# Altium project RK_NVR_DEMO1_RK3588_LP4XD200P232SD8_V21_20211228.PrjPcb (part 19 of 19)
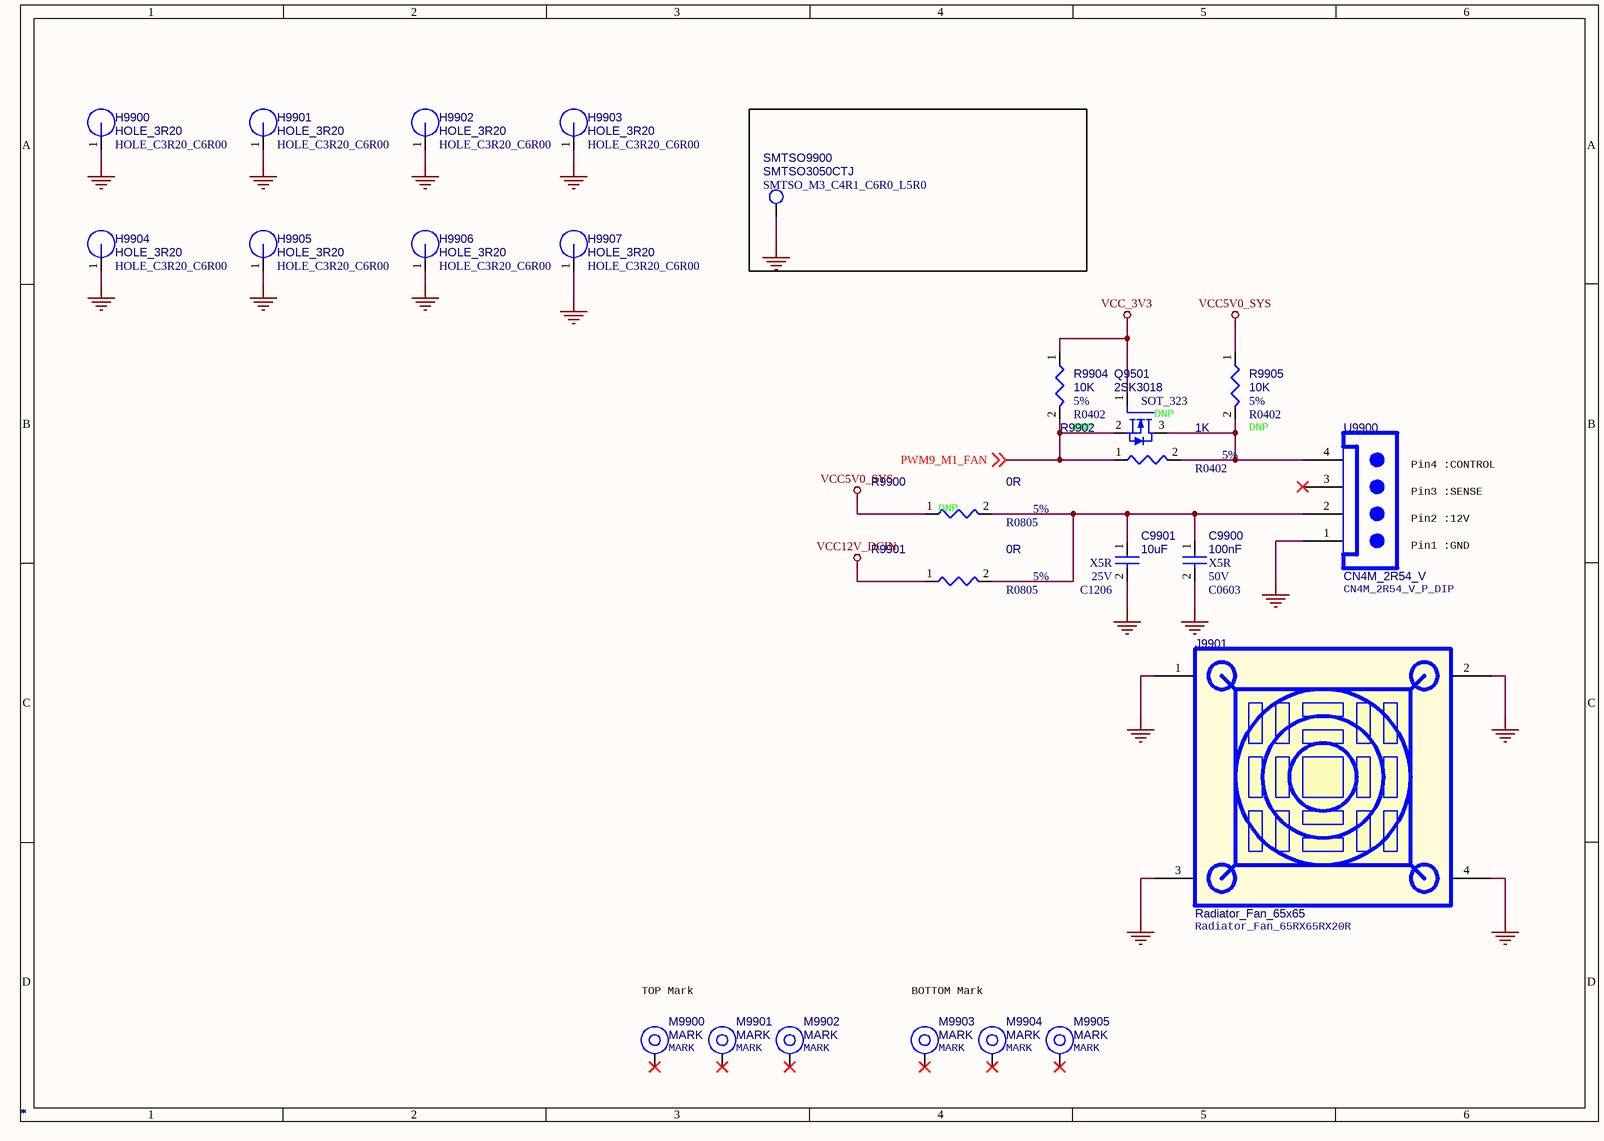
[diagram p81: 99.Mark_Hole_Heatsink.SchDoc]

## Nets that join several sheets
(0.75-0.85V): 12.RK3588 DDR Controler (C1215.1 C1218.1 U1000.L15 U1000.N12), 21.Power-PMIC_RK806-1 (R2141.2)
GND: 11.RK3588_OSC_PLL_PMUIO (19 pins), 12.RK3588 DDR Controler (33 pins), 13.RK3588_Flash_SD Controller (5 pins), 14.RK3588_USB30_USB20_Ctrl (18 pins), 15.RK3588_SARADC_1.8V Only GPIO (12 pins), 16.RK3588_MIPI  Interface (11 pins), 17.RK3588_HDMI_eDP Interface (23 pins), 18.RK3588_PCIE30_PCIE20_SATA30 (16 pins), 19.RK3588_1.8V_ 3.3V GPIO (C1901.2 C1902.2 C1903.2 C1905.2), 20.Power_DC IN (49 pins), 21.Power-PMIC_RK806-1 (69 pins), 22.Power_Ext Discrete_RTC IC (49 pins), 25.USB2_USB3_TypeC Port (75 pins), 38.DRAM-LPDDR4X_200P_1X32bit (205 pins), 40.Flash-eMMC Flash (23 pins), 43.Flash-SPI FLASH(Option) (C4300.2 C4301.2 U4300.4 U4300.9), 47.VI-Camera_MIPI-CSI (27 pins), 50.VO-HDMI2.1 TX (42 pins), 51.VO-HDMI2.0 TX(DP to HDMI) (69 pins), 55.VO-HDMI1.4 TX(MIPI to HDMI) (67 pins), 67.Ethernet-GEPHY_RGMII0 (50 pins), 68.Ethernet-GEPHY_RGMII1 (47 pins), 70.Audio Port (23 pins), 82.SATA-SATA PM0 (69 pins), 83.SATA-SATA PM1 (61 pins), 84.PCIE-PCIE3.0_1x4Lanes_RC_64P (71 pins), 90.IR Receiver_LED (11 pins), 91.Debug UART_JTAG (26 pins), 92.KEY (8 pins), 93.HW_ID (R9301.2), 95.RS485_RS232 (16 pins), 98.Power Test (21 pins), 99.Mark_Hole_Heatsink (16 pins)
VCC3V3_SATAPM0: 82.SATA-SATA PM0 (34 pins), 83.SATA-SATA PM1 (R8311.1)
VCC4V0_SYS: 20.Power_DC IN (6 pins), 21.Power-PMIC_RK806-1 (28 pins), 22.Power_Ext Discrete_RTC IC (18 pins), 51.VO-HDMI2.0 TX(DP to HDMI) (C5119.1 U5101.4), 55.VO-HDMI1.4 TX(MIPI to HDMI) (C5520.1 U5501.4), 82.SATA-SATA PM0 (5 pins), 84.PCIE-PCIE3.0_1x4Lanes_RC_64P (C8421.1 U8401.1)
VCC5V0_SYS: 20.Power_DC IN (C2035.1 R2001.1 R2024.2), 25.USB2_USB3_TypeC Port (12 pins), 47.VI-Camera_MIPI-CSI (C4700.1 C4701.1 U4700.77 U4700.79), 50.VO-HDMI2.1 TX (8 pins), 51.VO-HDMI2.0 TX(DP to HDMI) (D5100.1 D5101.1 R5120.1), 55.VO-HDMI1.4 TX(MIPI to HDMI) (D5500.1 D5501.1 R5540.1), 98.Power Test (J9800.5), 99.Mark_Hole_Heatsink (R9900.1 R9905.1)
VCC5V0_SYS_P: 20.Power_DC IN (7 pins), 98.Power Test (J9800.3)
VCC12V_DCIN: 20.Power_DC IN (14 pins), 47.VI-Camera_MIPI-CSI (C4702.1 C4703.1 U4700.80), 84.PCIE-PCIE3.0_1x4Lanes_RC_64P (7 pins), 99.Mark_Hole_Heatsink (R9901.1)
VCC_1V1_NLDO: 20.Power_DC IN (C2024.1 R2010.2 R2014.2), 21.Power-PMIC_RK806-1 (C2167.1 C2171.1 U2100.9 U2100.13)
VCC_1V8: 11.RK3588_OSC_PLL_PMUIO (C1107.1 C1112.1 U1000.N28 U1000.R27), 13.RK3588_Flash_SD Controller (C1300.1 C1301.1 U1000.AA7 U1000.V26), 15.RK3588_SARADC_1.8V Only GPIO (6 pins), 19.RK3588_1.8V_ 3.3V GPIO (10 pins), 21.Power-PMIC_RK806-1 (C2149.1 R2130.1 R2137.1 R2138.1), 38.DRAM-LPDDR4X_200P_1X32bit (C3843.1 R3803.2), 40.Flash-eMMC Flash (13 pins), 43.Flash-SPI FLASH(Option) (5 pins), 47.VI-Camera_MIPI-CSI (C4704.1 C4705.1 U4700.61), 50.VO-HDMI2.1 TX (R5000.1 R5005.1 R5014.1 R5017.1), 51.VO-HDMI2.0 TX(DP to HDMI) (R5135.1), 67.Ethernet-GEPHY_RGMII0 (R6730.1), 70.Audio Port (C7006.1 C7007.1 R7002.1 U7000.3), 98.Power Test (J9800.40)
VCC_1V8_P: 21.Power-PMIC_RK806-1 (5 pins), 98.Power Test (J9800.38)
VCC_2V0_PLDO: 20.Power_DC IN (R2014.1), 21.Power-PMIC_RK806-1 (C2154.1 C2156.1 R2131.2 U2100.59)
VCC_3V3: 11.RK3588_OSC_PLL_PMUIO (8 pins), 13.RK3588_Flash_SD Controller (C1302.1 U1000.Y7), 14.RK3588_USB30_USB20_Ctrl (C1421.1 U1000.AJ10), 19.RK3588_1.8V_ 3.3V GPIO (C1901.1 C1905.1 U1000.AC26 U1000.W26), 21.Power-PMIC_RK806-1 (C2140.1 R2127.1), 22.Power_Ext Discrete_RTC IC (D2200.2 R2204.1), 25.USB2_USB3_TypeC Port (C2519.1 R2500.2 U2503.3 U2503.4), 40.Flash-eMMC Flash (7 pins), 47.VI-Camera_MIPI-CSI (C4706.1 C4707.1 U4700.62), 50.VO-HDMI2.1 TX (10 pins), 51.VO-HDMI2.0 TX(DP to HDMI) (C5107.1 C5108.1 Q5100.2 R5126.1), 55.VO-HDMI1.4 TX(MIPI to HDMI) (C5503.1 C5504.1 Q5500.2 R5545.1), 67.Ethernet-GEPHY_RGMII0 (R6733.1), 68.Ethernet-GEPHY_RGMII1 (R6830.1 R6833.1), 70.Audio Port (BP7000.1 C7012.1), 82.SATA-SATA PM0 (R8211.1), 90.IR Receiver_LED (5 pins), 91.Debug UART_JTAG (5 pins), 95.RS485_RS232 (6 pins), 98.Power Test (J9800.11), 99.Mark_Hole_Heatsink (Q9501.1 R9904.1)
VCC_3V3_P: 21.Power-PMIC_RK806-1 (5 pins), 98.Power Test (J9800.9)
VCCA1V2_IMAGE: 16.RK3588_MIPI  Interface (C1608.1 C1609.1 U1000.AH19), 21.Power-PMIC_RK806-1 (C2159.1 U2100.57)
VCCA1V8_IMAGE: 16.RK3588_MIPI  Interface (7 pins), 17.RK3588_HDMI_eDP Interface (10 pins), 21.Power-PMIC_RK806-1 (R2133.2), 98.Power Test (J9800.30)
VCCA1V8_IMAGE_P: 21.Power-PMIC_RK806-1 (C2157.1 R2133.1 U2100.58), 98.Power Test (J9800.28)
VCCA1V8_PLDO6: 21.Power-PMIC_RK806-1 (C2158.1 U2100.20), 38.DRAM-LPDDR4X_200P_1X32bit (R3800.2)
VCCA_1V8: 11.RK3588_OSC_PLL_PMUIO (5 pins), 12.RK3588 DDR Controler (C1214.1 C1217.1 U1000.K16 U1000.M12), 14.RK3588_USB30_USB20_Ctrl (9 pins), 15.RK3588_SARADC_1.8V Only GPIO (C1503.1 R1502.1 R1503.1 U1000.AH18), 18.RK3588_PCIE30_PCIE20_SATA30 (12 pins), 21.Power-PMIC_RK806-1 (R2132.2), 93.HW_ID (R9300.1), 98.Power Test (J9800.24)
VCCA_1V8_P: 21.Power-PMIC_RK806-1 (C2155.1 R2132.1 U2100.60), 98.Power Test (J9800.22)
VCCA_3V3: 21.Power-PMIC_RK806-1 (R2135.2), 70.Audio Port (6 pins)
VDD1V2_SATAPM0: 82.SATA-SATA PM0 (22 pins), 83.SATA-SATA PM1 (R8312.1)
VDD2_DDR: 12.RK3588 DDR Controler (R1205.2), 21.Power-PMIC_RK806-1 (C2100.1 R2102.1), 38.DRAM-LPDDR4X_200P_1X32bit (83 pins), 98.Power Test (J9800.46)
VDD2_DDR_P: 21.Power-PMIC_RK806-1 (7 pins), 98.Power Test (J9800.44)
VDD_CPU_BIG0: 22.Power_Ext Discrete_RTC IC (8 pins), 98.Power Test (J9800.17)
VDD_CPU_BIG0_P: 22.Power_Ext Discrete_RTC IC (9 pins), 98.Power Test (J9800.15)
VDD_CPU_BIG1: 22.Power_Ext Discrete_RTC IC (9 pins), 98.Power Test (J9800.23)
VDD_CPU_BIG1_P: 22.Power_Ext Discrete_RTC IC (9 pins), 98.Power Test (J9800.21)
VDD_CPU_LIT: 21.Power-PMIC_RK806-1 (7 pins), 98.Power Test (J9800.52)
VDD_CPU_LIT_P: 21.Power-PMIC_RK806-1 (7 pins), 98.Power Test (J9800.50)
VDD_DDR: 12.RK3588 DDR Controler (22 pins), 21.Power-PMIC_RK806-1 (6 pins), 98.Power Test (J9800.39)
VDD_DDR_P: 21.Power-PMIC_RK806-1 (7 pins), 98.Power Test (J9800.37)
VDD_GPU: 21.Power-PMIC_RK806-1 (7 pins), 98.Power Test (J9800.45)
VDD_GPU_P: 21.Power-PMIC_RK806-1 (7 pins), 98.Power Test (J9800.43)
VDD_LOGIC: 21.Power-PMIC_RK806-1 (7 pins), 98.Power Test (J9800.51)
VDD_LOGIC_P: 21.Power-PMIC_RK806-1 (7 pins), 98.Power Test (J9800.49)
VDD_NPU: 22.Power_Ext Discrete_RTC IC (6 pins), 98.Power Test (J9800.57)
VDD_NPU_P: 22.Power_Ext Discrete_RTC IC (9 pins), 98.Power Test (J9800.55)
VDD_VDENC: 21.Power-PMIC_RK806-1 (7 pins), 98.Power Test (J9800.34)
VDD_VDENC_P: 21.Power-PMIC_RK806-1 (7 pins), 98.Power Test (J9800.32)
VDDA0V75_IMAGE: 17.RK3588_HDMI_eDP Interface (11 pins), 21.Power-PMIC_RK806-1 (R2142.2), 98.Power Test (J9800.18)
VDDA0V75_IMAGE_P: 21.Power-PMIC_RK806-1 (C2169.1 R2142.1 U2100.11), 98.Power Test (J9800.16)
VDDA_0V75: 14.RK3588_USB30_USB20_Ctrl (C1412.1 U1000.AH10), 15.RK3588_SARADC_1.8V Only GPIO (C1504.1 U1000.AD3), 16.RK3588_MIPI  Interface (8 pins), 18.RK3588_PCIE30_PCIE20_SATA30 (6 pins), 21.Power-PMIC_RK806-1 (R2144.2), 98.Power Test (J9800.33)
VDDA_0V75_P: 21.Power-PMIC_RK806-1 (C2172.1 R2144.1 U2100.8), 98.Power Test (J9800.31)
VDDA_0V75_PMU: 11.RK3588_OSC_PLL_PMUIO (6 pins), 21.Power-PMIC_RK806-1 (R2139.2), 98.Power Test (J9800.12)
VDDA_0V75_PMU_P: 21.Power-PMIC_RK806-1 (C2164.1 R2139.1 U2100.14), 98.Power Test (J9800.10)
VDDA_0V85: 14.RK3588_USB30_USB20_Ctrl (8 pins), 18.RK3588_PCIE30_PCIE20_SATA30 (6 pins), 21.Power-PMIC_RK806-1 (R2143.2), 98.Power Test (J9800.6)
VDDA_0V85_P: 21.Power-PMIC_RK806-1 (C2170.1 R2143.1 U2100.10), 98.Power Test (J9800.4)
VDDQ_DDR: 12.RK3588 DDR Controler (27 pins), 21.Power-PMIC_RK806-1 (8 pins), 38.DRAM-LPDDR4X_200P_1X32bit (R3808.2), 98.Power Test (J9800.29)
VDDQ_DDR_P: 21.Power-PMIC_RK806-1 (7 pins), 98.Power Test (J9800.27)
DDR_CH0_A0_A: 12.RK3588 DDR Controler (U1000.T7), 38.DRAM-LPDDR4X_200P_1X32bit (U3800.H2)
DDR_CH0_A0_B: 12.RK3588 DDR Controler (U1000.M8), 38.DRAM-LPDDR4X_200P_1X32bit (U3800.R2)
DDR_CH0_A1_A: 12.RK3588 DDR Controler (U1000.T8), 38.DRAM-LPDDR4X_200P_1X32bit (U3800.J2)
DDR_CH0_A1_B: 12.RK3588 DDR Controler (U1000.M5), 38.DRAM-LPDDR4X_200P_1X32bit (U3800.P2)
DDR_CH0_A2_A: 12.RK3588 DDR Controler (U1000.P4), 38.DRAM-LPDDR4X_200P_1X32bit (U3800.H9)
DDR_CH0_A2_B: 12.RK3588 DDR Controler (U1000.N5), 38.DRAM-LPDDR4X_200P_1X32bit (U3800.R9)
DDR_CH0_A3_A: 12.RK3588 DDR Controler (U1000.P5), 38.DRAM-LPDDR4X_200P_1X32bit (U3800.H10)
DDR_CH0_A3_B: 12.RK3588 DDR Controler (U1000.N4), 38.DRAM-LPDDR4X_200P_1X32bit (U3800.R10)
DDR_CH0_A4_A: 12.RK3588 DDR Controler (U1000.R1), 38.DRAM-LPDDR4X_200P_1X32bit (U3800.H11)
DDR_CH0_A4_B: 12.RK3588 DDR Controler (U1000.K1), 38.DRAM-LPDDR4X_200P_1X32bit (U3800.R11)
DDR_CH0_A5_A: 12.RK3588 DDR Controler (U1000.P2), 38.DRAM-LPDDR4X_200P_1X32bit (U3800.J11)
DDR_CH0_A5_B: 12.RK3588 DDR Controler (U1000.L2), 38.DRAM-LPDDR4X_200P_1X32bit (U3800.P11)
DDR_CH0_CLKN_A: 12.RK3588 DDR Controler (U1000.N1), 38.DRAM-LPDDR4X_200P_1X32bit (U3800.J9)
DDR_CH0_CLKN_B: 12.RK3588 DDR Controler (U1000.M1), 38.DRAM-LPDDR4X_200P_1X32bit (U3800.P9)
DDR_CH0_CLKP_A: 12.RK3588 DDR Controler (U1000.N2), 38.DRAM-LPDDR4X_200P_1X32bit (U3800.J8)
DDR_CH0_CLKP_B: 12.RK3588 DDR Controler (U1000.M2), 38.DRAM-LPDDR4X_200P_1X32bit (U3800.P8)
DDR_CH0_DM0_A: 12.RK3588 DDR Controler (U1000.Y4), 38.DRAM-LPDDR4X_200P_1X32bit (U3800.C3)
DDR_CH0_DM0_B: 12.RK3588 DDR Controler (U1000.G4), 38.DRAM-LPDDR4X_200P_1X32bit (U3800.Y3)
DDR_CH0_DM1_A: 12.RK3588 DDR Controler (U1000.AB4), 38.DRAM-LPDDR4X_200P_1X32bit (U3800.C10)
DDR_CH0_DM1_B: 12.RK3588 DDR Controler (U1000.E4), 38.DRAM-LPDDR4X_200P_1X32bit (U3800.Y10)
DDR_CH0_DQ0_A: 12.RK3588 DDR Controler (U1000.U1), 38.DRAM-LPDDR4X_200P_1X32bit (U3800.B2)
DDR_CH0_DQ0_B: 12.RK3588 DDR Controler (U1000.H1), 38.DRAM-LPDDR4X_200P_1X32bit (U3800.AA2)
DDR_CH0_DQ1_A: 12.RK3588 DDR Controler (U1000.T2), 38.DRAM-LPDDR4X_200P_1X32bit (U3800.C2)
DDR_CH0_DQ1_B: 12.RK3588 DDR Controler (U1000.J2), 38.DRAM-LPDDR4X_200P_1X32bit (U3800.Y2)
DDR_CH0_DQ2_A: 12.RK3588 DDR Controler (U1000.T1), 38.DRAM-LPDDR4X_200P_1X32bit (U3800.E2)
DDR_CH0_DQ2_B: 12.RK3588 DDR Controler (U1000.J1), 38.DRAM-LPDDR4X_200P_1X32bit (U3800.V2)
DDR_CH0_DQ3_A: 12.RK3588 DDR Controler (U1000.R2), 38.DRAM-LPDDR4X_200P_1X32bit (U3800.F2)
DDR_CH0_DQ3_B: 12.RK3588 DDR Controler (U1000.K2), 38.DRAM-LPDDR4X_200P_1X32bit (U3800.U2)
DDR_CH0_DQ4_A: 12.RK3588 DDR Controler (U1000.W1), 38.DRAM-LPDDR4X_200P_1X32bit (U3800.F4)
DDR_CH0_DQ4_B: 12.RK3588 DDR Controler (U1000.F1), 38.DRAM-LPDDR4X_200P_1X32bit (U3800.U4)
DDR_CH0_DQ5_A: 12.RK3588 DDR Controler (U1000.V2), 38.DRAM-LPDDR4X_200P_1X32bit (U3800.E4)
DDR_CH0_DQ5_B: 12.RK3588 DDR Controler (U1000.G2), 38.DRAM-LPDDR4X_200P_1X32bit (U3800.V4)
DDR_CH0_DQ6_A: 12.RK3588 DDR Controler (U1000.V1), 38.DRAM-LPDDR4X_200P_1X32bit (U3800.C4)
DDR_CH0_DQ6_B: 12.RK3588 DDR Controler (U1000.G1), 38.DRAM-LPDDR4X_200P_1X32bit (U3800.Y4)
DDR_CH0_DQ7_A: 12.RK3588 DDR Controler (U1000.U2), 38.DRAM-LPDDR4X_200P_1X32bit (U3800.B4)
DDR_CH0_DQ7_B: 12.RK3588 DDR Controler (U1000.H2), 38.DRAM-LPDDR4X_200P_1X32bit (U3800.AA4)
DDR_CH0_DQ8_A: 12.RK3588 DDR Controler (U1000.AB2), 38.DRAM-LPDDR4X_200P_1X32bit (U3800.B11)
DDR_CH0_DQ8_B: 12.RK3588 DDR Controler (U1000.D2), 38.DRAM-LPDDR4X_200P_1X32bit (U3800.AA11)
DDR_CH0_DQ9_A: 12.RK3588 DDR Controler (U1000.AB1), 38.DRAM-LPDDR4X_200P_1X32bit (U3800.C11)
DDR_CH0_DQ9_B: 12.RK3588 DDR Controler (U1000.C1), 38.DRAM-LPDDR4X_200P_1X32bit (U3800.Y11)
DDR_CH0_DQ10_A: 12.RK3588 DDR Controler (U1000.AC1), 38.DRAM-LPDDR4X_200P_1X32bit (U3800.E11)
DDR_CH0_DQ10_B: 12.RK3588 DDR Controler (U1000.C2), 38.DRAM-LPDDR4X_200P_1X32bit (U3800.V11)
DDR_CH0_DQ11_A: 12.RK3588 DDR Controler (U1000.AC2), 38.DRAM-LPDDR4X_200P_1X32bit (U3800.F11)
DDR_CH0_DQ11_B: 12.RK3588 DDR Controler (U1000.B1), 38.DRAM-LPDDR4X_200P_1X32bit (U3800.U11)
DDR_CH0_DQ12_A: 12.RK3588 DDR Controler (U1000.Y1), 38.DRAM-LPDDR4X_200P_1X32bit (U3800.F9)
DDR_CH0_DQ12_B: 12.RK3588 DDR Controler (U1000.F2), 38.DRAM-LPDDR4X_200P_1X32bit (U3800.U9)
DDR_CH0_DQ13_A: 12.RK3588 DDR Controler (U1000.Y2), 38.DRAM-LPDDR4X_200P_1X32bit (U3800.E9)
DDR_CH0_DQ13_B: 12.RK3588 DDR Controler (U1000.E1), 38.DRAM-LPDDR4X_200P_1X32bit (U3800.V9)
DDR_CH0_DQ14_A: 12.RK3588 DDR Controler (U1000.AA1), 38.DRAM-LPDDR4X_200P_1X32bit (U3800.C9)
DDR_CH0_DQ14_B: 12.RK3588 DDR Controler (U1000.E2), 38.DRAM-LPDDR4X_200P_1X32bit (U3800.Y9)
DDR_CH0_DQ15_A: 12.RK3588 DDR Controler (U1000.AA2), 38.DRAM-LPDDR4X_200P_1X32bit (U3800.B9)
DDR_CH0_DQ15_B: 12.RK3588 DDR Controler (U1000.D1), 38.DRAM-LPDDR4X_200P_1X32bit (U3800.AA9)
DDR_CH0_DQS0N_A: 12.RK3588 DDR Controler (U1000.U4), 38.DRAM-LPDDR4X_200P_1X32bit (U3800.E3)
DDR_CH0_DQS0N_B: 12.RK3588 DDR Controler (U1000.J7), 38.DRAM-LPDDR4X_200P_1X32bit (U3800.V3)
DDR_CH0_DQS0P_A: 12.RK3588 DDR Controler (U1000.U5), 38.DRAM-LPDDR4X_200P_1X32bit (U3800.D3)
DDR_CH0_DQS0P_B: 12.RK3588 DDR Controler (U1000.J8), 38.DRAM-LPDDR4X_200P_1X32bit (U3800.W3)
DDR_CH0_DQS1N_A: 12.RK3588 DDR Controler (U1000.AA4), 38.DRAM-LPDDR4X_200P_1X32bit (U3800.E10)
DDR_CH0_DQS1N_B: 12.RK3588 DDR Controler (U1000.F4), 38.DRAM-LPDDR4X_200P_1X32bit (U3800.V10)
DDR_CH0_DQS1P_A: 12.RK3588 DDR Controler (U1000.AA5), 38.DRAM-LPDDR4X_200P_1X32bit (U3800.D10)
DDR_CH0_DQS1P_B: 12.RK3588 DDR Controler (U1000.F5), 38.DRAM-LPDDR4X_200P_1X32bit (U3800.W10)
DDR_CH0_LP4/4X_CKE0/LP5_CS0_A: 12.RK3588 DDR Controler (U1000.P7), 38.DRAM-LPDDR4X_200P_1X32bit (R3801.1)
DDR_CH0_LP4/4X_CKE0/LP5_CS0_B: 12.RK3588 DDR Controler (U1000.L5), 38.DRAM-LPDDR4X_200P_1X32bit (R3804.1)
DDR_CH0_LP4/4X_CKE1/LP5_CS1_A: 12.RK3588 DDR Controler (U1000.N7), 38.DRAM-LPDDR4X_200P_1X32bit (R3802.1)
DDR_CH0_LP4/4X_CKE1/LP5_CS1_B: 12.RK3588 DDR Controler (U1000.L4), 38.DRAM-LPDDR4X_200P_1X32bit (R3805.1)
DDR_CH0_LP4/4X_CS0_A: 12.RK3588 DDR Controler (U1000.R6), 38.DRAM-LPDDR4X_200P_1X32bit (U3800.H4)
DDR_CH0_LP4/4X_CS0_B: 12.RK3588 DDR Controler (U1000.L7), 38.DRAM-LPDDR4X_200P_1X32bit (U3800.R4)
DDR_CH0_LP4/4X_CS1_A: 12.RK3588 DDR Controler (U1000.R7), 38.DRAM-LPDDR4X_200P_1X32bit (U3800.H3)
DDR_CH0_LP4/4X_CS1_B: 12.RK3588 DDR Controler (U1000.L8), 38.DRAM-LPDDR4X_200P_1X32bit (U3800.R3)
DDR_CH1_A0_C: 12.RK3588 DDR Controler (U1000.G12), 38.DRAM-LPDDR4X_200P_1X32bit (U3801.H2)
DDR_CH1_A0_D: 12.RK3588 DDR Controler (U1000.H15), 38.DRAM-LPDDR4X_200P_1X32bit (U3801.R2)
DDR_CH1_A1_C: 12.RK3588 DDR Controler (U1000.F12), 38.DRAM-LPDDR4X_200P_1X32bit (U3801.J2)
DDR_CH1_A1_D: 12.RK3588 DDR Controler (U1000.G14), 38.DRAM-LPDDR4X_200P_1X32bit (U3801.P2)
DDR_CH1_A2_C: 12.RK3588 DDR Controler (U1000.E13), 38.DRAM-LPDDR4X_200P_1X32bit (U3801.H9)
DDR_CH1_A2_D: 12.RK3588 DDR Controler (U1000.G13), 38.DRAM-LPDDR4X_200P_1X32bit (U3801.R9)
DDR_CH1_A3_C: 12.RK3588 DDR Controler (U1000.D13), 38.DRAM-LPDDR4X_200P_1X32bit (U3801.H10)
DDR_CH1_A3_D: 12.RK3588 DDR Controler (U1000.E14), 38.DRAM-LPDDR4X_200P_1X32bit (U3801.R10)
DDR_CH1_A4_C: 12.RK3588 DDR Controler (U1000.A10), 38.DRAM-LPDDR4X_200P_1X32bit (U3801.H11)
DDR_CH1_A4_D: 12.RK3588 DDR Controler (U1000.A15), 38.DRAM-LPDDR4X_200P_1X32bit (U3801.R11)
DDR_CH1_A5_C: 12.RK3588 DDR Controler (U1000.B11), 38.DRAM-LPDDR4X_200P_1X32bit (U3801.J11)
DDR_CH1_A5_D: 12.RK3588 DDR Controler (U1000.B14), 38.DRAM-LPDDR4X_200P_1X32bit (U3801.P11)
DDR_CH1_CLKN_C: 12.RK3588 DDR Controler (U1000.A12), 38.DRAM-LPDDR4X_200P_1X32bit (U3801.J9)
DDR_CH1_CLKN_D: 12.RK3588 DDR Controler (U1000.A13), 38.DRAM-LPDDR4X_200P_1X32bit (U3801.P9)
DDR_CH1_CLKP_C: 12.RK3588 DDR Controler (U1000.B12), 38.DRAM-LPDDR4X_200P_1X32bit (U3801.J8)
DDR_CH1_CLKP_D: 12.RK3588 DDR Controler (U1000.B13), 38.DRAM-LPDDR4X_200P_1X32bit (U3801.P8)
DDR_CH1_DM0_C: 12.RK3588 DDR Controler (U1000.F8), 38.DRAM-LPDDR4X_200P_1X32bit (U3801.C3)
DDR_CH1_DM0_D: 12.RK3588 DDR Controler (U1000.D20), 38.DRAM-LPDDR4X_200P_1X32bit (U3801.Y3)
DDR_CH1_DM1_C: 12.RK3588 DDR Controler (U1000.D4), 38.DRAM-LPDDR4X_200P_1X32bit (U3801.C10)
DDR_CH1_DM1_D: 12.RK3588 DDR Controler (U1000.D22), 38.DRAM-LPDDR4X_200P_1X32bit (U3801.Y10)
DDR_CH1_DQ0_C: 12.RK3588 DDR Controler (U1000.A8), 38.DRAM-LPDDR4X_200P_1X32bit (U3801.B2)
DDR_CH1_DQ0_D: 12.RK3588 DDR Controler (U1000.A17), 38.DRAM-LPDDR4X_200P_1X32bit (U3801.AA2)
DDR_CH1_DQ1_C: 12.RK3588 DDR Controler (U1000.B9), 38.DRAM-LPDDR4X_200P_1X32bit (U3801.C2)
DDR_CH1_DQ1_D: 12.RK3588 DDR Controler (U1000.B16), 38.DRAM-LPDDR4X_200P_1X32bit (U3801.Y2)
DDR_CH1_DQ2_C: 12.RK3588 DDR Controler (U1000.A9), 38.DRAM-LPDDR4X_200P_1X32bit (U3801.E2)
DDR_CH1_DQ2_D: 12.RK3588 DDR Controler (U1000.A16), 38.DRAM-LPDDR4X_200P_1X32bit (U3801.V2)
DDR_CH1_DQ3_C: 12.RK3588 DDR Controler (U1000.B10), 38.DRAM-LPDDR4X_200P_1X32bit (U3801.F2)
DDR_CH1_DQ3_D: 12.RK3588 DDR Controler (U1000.B15), 38.DRAM-LPDDR4X_200P_1X32bit (U3801.U2)
DDR_CH1_DQ4_C: 12.RK3588 DDR Controler (U1000.A6), 38.DRAM-LPDDR4X_200P_1X32bit (U3801.F4)
DDR_CH1_DQ4_D: 12.RK3588 DDR Controler (U1000.A19), 38.DRAM-LPDDR4X_200P_1X32bit (U3801.U4)
DDR_CH1_DQ5_C: 12.RK3588 DDR Controler (U1000.B7), 38.DRAM-LPDDR4X_200P_1X32bit (U3801.E4)
DDR_CH1_DQ5_D: 12.RK3588 DDR Controler (U1000.B18), 38.DRAM-LPDDR4X_200P_1X32bit (U3801.V4)
DDR_CH1_DQ6_C: 12.RK3588 DDR Controler (U1000.A7), 38.DRAM-LPDDR4X_200P_1X32bit (U3801.C4)
DDR_CH1_DQ6_D: 12.RK3588 DDR Controler (U1000.A18), 38.DRAM-LPDDR4X_200P_1X32bit (U3801.Y4)
DDR_CH1_DQ7_C: 12.RK3588 DDR Controler (U1000.B8), 38.DRAM-LPDDR4X_200P_1X32bit (U3801.B4)
DDR_CH1_DQ7_D: 12.RK3588 DDR Controler (U1000.B17), 38.DRAM-LPDDR4X_200P_1X32bit (U3801.AA4)
DDR_CH1_DQ8_C: 12.RK3588 DDR Controler (U1000.A3), 38.DRAM-LPDDR4X_200P_1X32bit (U3801.B11)
DDR_CH1_DQ8_D: 12.RK3588 DDR Controler (U1000.A22), 38.DRAM-LPDDR4X_200P_1X32bit (U3801.AA11)
DDR_CH1_DQ9_C: 12.RK3588 DDR Controler (U1000.B3), 38.DRAM-LPDDR4X_200P_1X32bit (U3801.C11)
DDR_CH1_DQ9_D: 12.RK3588 DDR Controler (U1000.B22), 38.DRAM-LPDDR4X_200P_1X32bit (U3801.Y11)
DDR_CH1_DQ10_C: 12.RK3588 DDR Controler (U1000.A2), 38.DRAM-LPDDR4X_200P_1X32bit (U3801.E11)
DDR_CH1_DQ10_D: 12.RK3588 DDR Controler (U1000.A23), 38.DRAM-LPDDR4X_200P_1X32bit (U3801.V11)
DDR_CH1_DQ11_C: 12.RK3588 DDR Controler (U1000.B2), 38.DRAM-LPDDR4X_200P_1X32bit (U3801.F11)
DDR_CH1_DQ11_D: 12.RK3588 DDR Controler (U1000.B23), 38.DRAM-LPDDR4X_200P_1X32bit (U3801.U11)
DDR_CH1_DQ12_C: 12.RK3588 DDR Controler (U1000.A5), 38.DRAM-LPDDR4X_200P_1X32bit (U3801.F9)
DDR_CH1_DQ12_D: 12.RK3588 DDR Controler (U1000.A20), 38.DRAM-LPDDR4X_200P_1X32bit (U3801.U9)
DDR_CH1_DQ13_C: 12.RK3588 DDR Controler (U1000.B5), 38.DRAM-LPDDR4X_200P_1X32bit (U3801.E9)
DDR_CH1_DQ13_D: 12.RK3588 DDR Controler (U1000.B20), 38.DRAM-LPDDR4X_200P_1X32bit (U3801.V9)
DDR_CH1_DQ14_C: 12.RK3588 DDR Controler (U1000.A4), 38.DRAM-LPDDR4X_200P_1X32bit (U3801.C9)
DDR_CH1_DQ14_D: 12.RK3588 DDR Controler (U1000.A21), 38.DRAM-LPDDR4X_200P_1X32bit (U3801.Y9)
DDR_CH1_DQ15_C: 12.RK3588 DDR Controler (U1000.B4), 38.DRAM-LPDDR4X_200P_1X32bit (U3801.B9)
DDR_CH1_DQ15_D: 12.RK3588 DDR Controler (U1000.B21), 38.DRAM-LPDDR4X_200P_1X32bit (U3801.AA9)
DDR_CH1_DQS0N_C: 12.RK3588 DDR Controler (U1000.D9), 38.DRAM-LPDDR4X_200P_1X32bit (U3801.E3)
DDR_CH1_DQS0N_D: 12.RK3588 DDR Controler (U1000.G16), 38.DRAM-LPDDR4X_200P_1X32bit (U3801.V3)
DDR_CH1_DQS0P_C: 12.RK3588 DDR Controler (U1000.E9), 38.DRAM-LPDDR4X_200P_1X32bit (U3801.D3)
DDR_CH1_DQS0P_D: 12.RK3588 DDR Controler (U1000.H16), 38.DRAM-LPDDR4X_200P_1X32bit (U3801.W3)
DDR_CH1_DQS1N_C: 12.RK3588 DDR Controler (U1000.D5), 38.DRAM-LPDDR4X_200P_1X32bit (U3801.E10)
DDR_CH1_DQS1N_D: 12.RK3588 DDR Controler (U1000.E21), 38.DRAM-LPDDR4X_200P_1X32bit (U3801.V10)
DDR_CH1_DQS1P_C: 12.RK3588 DDR Controler (U1000.E5), 38.DRAM-LPDDR4X_200P_1X32bit (U3801.D10)
DDR_CH1_DQS1P_D: 12.RK3588 DDR Controler (U1000.D21), 38.DRAM-LPDDR4X_200P_1X32bit (U3801.W10)
DDR_CH1_LP4/4X_CKE0/LP5_CS0_C: 12.RK3588 DDR Controler (U1000.D11), 38.DRAM-LPDDR4X_200P_1X32bit (R3812.1)
DDR_CH1_LP4/4X_CKE0/LP5_CS0_D: 12.RK3588 DDR Controler (U1000.D16), 38.DRAM-LPDDR4X_200P_1X32bit (R3814.1)
DDR_CH1_LP4/4X_CKE1/LP5_CS1_C: 12.RK3588 DDR Controler (U1000.E11), 38.DRAM-LPDDR4X_200P_1X32bit (R3813.1)
DDR_CH1_LP4/4X_CKE1/LP5_CS1_D: 12.RK3588 DDR Controler (U1000.E16), 38.DRAM-LPDDR4X_200P_1X32bit (R3815.1)
DDR_CH1_LP4/4X_CS0_C: 12.RK3588 DDR Controler (U1000.G11), 38.DRAM-LPDDR4X_200P_1X32bit (U3801.H4)
DDR_CH1_LP4/4X_CS0_D: 12.RK3588 DDR Controler (U1000.E19), 38.DRAM-LPDDR4X_200P_1X32bit (U3801.R4)
DDR_CH1_LP4/4X_CS1_C: 12.RK3588 DDR Controler (U1000.H11), 38.DRAM-LPDDR4X_200P_1X32bit (U3801.H3)
DDR_CH1_LP4/4X_CS1_D: 12.RK3588 DDR Controler (U1000.D19), 38.DRAM-LPDDR4X_200P_1X32bit (U3801.R3)
DDR_RESET: 12.RK3588 DDR Controler (U1000.T4), 38.DRAM-LPDDR4X_200P_1X32bit (C3844.1 C3888.1 U3800.T11 U3801.T11)
DP1_AUXN: 14.RK3588_USB30_USB20_Ctrl (U1000.AM10), 51.VO-HDMI2.0 TX(DP to HDMI) (C5100.1)
DP1_AUXP: 14.RK3588_USB30_USB20_Ctrl (U1000.AL10), 51.VO-HDMI2.0 TX(DP to HDMI) (C5101.1)
DP1_HPDIN_M2: 19.RK3588_1.8V_ 3.3V GPIO (U1000.A25), 51.VO-HDMI2.0 TX(DP to HDMI) (D5102.1 R5100.1 R5101.1 R5135.2)
DP1_TX0N: 14.RK3588_USB30_USB20_Ctrl (C1409.2), 51.VO-HDMI2.0 TX(DP to HDMI) (U5100.30)
DP1_TX0P: 14.RK3588_USB30_USB20_Ctrl (C1408.2), 51.VO-HDMI2.0 TX(DP to HDMI) (U5100.29)
DP1_TX1N: 14.RK3588_USB30_USB20_Ctrl (C1411.2), 51.VO-HDMI2.0 TX(DP to HDMI) (U5100.33)
DP1_TX1P: 14.RK3588_USB30_USB20_Ctrl (C1410.2), 51.VO-HDMI2.0 TX(DP to HDMI) (U5100.32)
DP1_TX2N: 14.RK3588_USB30_USB20_Ctrl (C1414.2), 51.VO-HDMI2.0 TX(DP to HDMI) (U5100.35)
DP1_TX2P: 14.RK3588_USB30_USB20_Ctrl (C1413.2), 51.VO-HDMI2.0 TX(DP to HDMI) (U5100.34)
DP1_TX3N: 14.RK3588_USB30_USB20_Ctrl (C1416.2), 51.VO-HDMI2.0 TX(DP to HDMI) (U5100.38)
DP1_TX3P: 14.RK3588_USB30_USB20_Ctrl (C1415.2), 51.VO-HDMI2.0 TX(DP to HDMI) (U5100.37)
DP2HDMI_PWREN_H_GPIO3_B2: 19.RK3588_1.8V_ 3.3V GPIO (U1000.AE28), 51.VO-HDMI2.0 TX(DP to HDMI) (R5129.1 R5131.1), 55.VO-HDMI1.4 TX(MIPI to HDMI) (R5549.1 R5552.1)
DP2HDMI_RSTn_GPIO0_D5: 11.RK3588_OSC_PLL_PMUIO (U1000.V28), 51.VO-HDMI2.0 TX(DP to HDMI) (R5122.1)
eMMC_CLKOUT: 13.RK3588_Flash_SD Controller (R1310.2 TP1300.1), 40.Flash-eMMC Flash (C4010.1 U4000.M6)
eMMC_CMD: 13.RK3588_Flash_SD Controller (R1315.2), 40.Flash-eMMC Flash (R4001.2 U4000.M5)
eMMC_D0: 13.RK3588_Flash_SD Controller (R1309.2), 40.Flash-eMMC Flash (R4000.2 U4000.A3)
eMMC_D1: 13.RK3588_Flash_SD Controller (R1311.2), 40.Flash-eMMC Flash (U4000.A4)
eMMC_D2: 13.RK3588_Flash_SD Controller (R1313.2), 40.Flash-eMMC Flash (U4000.A5)
eMMC_D3: 13.RK3588_Flash_SD Controller (R1314.2), 40.Flash-eMMC Flash (U4000.B2)
eMMC_D4: 13.RK3588_Flash_SD Controller (R1305.2), 40.Flash-eMMC Flash (U4000.B3)
eMMC_D5: 13.RK3588_Flash_SD Controller (R1306.2), 40.Flash-eMMC Flash (U4000.B4)
eMMC_D6: 13.RK3588_Flash_SD Controller (R1316.2), 40.Flash-eMMC Flash (U4000.B5)
eMMC_D7: 13.RK3588_Flash_SD Controller (R1308.2), 40.Flash-eMMC Flash (U4000.B6)
eMMC_DATA_STROBE: 13.RK3588_Flash_SD Controller (U1000.Y34), 40.Flash-eMMC Flash (R4003.1)
eMMC_RSTn: 13.RK3588_Flash_SD Controller (R1312.2), 40.Flash-eMMC Flash (C4009.1 R4002.2 U4000.K5)
ETH0_REFCLKO_25M: 15.RK3588_SARADC_1.8V Only GPIO (R1511.2), 67.Ethernet-GEPHY_RGMII0 (R6709.1)
ETH1_REFCLKO_25M: 19.RK3588_1.8V_ 3.3V GPIO (R1906.2), 68.Ethernet-GEPHY_RGMII1 (R6809.1)
Ethernet_LED_EN_H_GPIO3_C0: 19.RK3588_1.8V_ 3.3V GPIO (U1000.Y29), 90.IR Receiver_LED (R9007.1)
FSPI_CLK: 13.RK3588_Flash_SD Controller (R1304.2 TP1302.1), 43.Flash-SPI FLASH(Option) (U4300.6)
FSPI_CS0: 13.RK3588_Flash_SD Controller (R1307.2), 43.Flash-SPI FLASH(Option) (U4300.1)
FSPI_D0: 13.RK3588_Flash_SD Controller (R1300.2), 43.Flash-SPI FLASH(Option) (U4300.5)
FSPI_D1: 13.RK3588_Flash_SD Controller (R1301.2), 43.Flash-SPI FLASH(Option) (U4300.2)
FSPI_D2: 13.RK3588_Flash_SD Controller (R1302.2), 43.Flash-SPI FLASH(Option) (R4300.2 U4300.3)
FSPI_D3: 13.RK3588_Flash_SD Controller (R1303.2), 43.Flash-SPI FLASH(Option) (R4301.2 U4300.7)
GMAC0_MCLKINOUT: 15.RK3588_SARADC_1.8V Only GPIO (R1512.2), 67.Ethernet-GEPHY_RGMII0 (C6706.1 R6714.1 R6715.1)
GMAC0_MDC: 15.RK3588_SARADC_1.8V Only GPIO (R1513.2), 67.Ethernet-GEPHY_RGMII0 (U6701.13)
GMAC0_MDIO: 15.RK3588_SARADC_1.8V Only GPIO (U1000.AB33), 67.Ethernet-GEPHY_RGMII0 (R6735.2 U6701.14)
GMAC0_RSTn_L_GPIO4_B3: 19.RK3588_1.8V_ 3.3V GPIO (U1000.AM25), 67.Ethernet-GEPHY_RGMII0 (R6736.1)
GMAC0_RXCLK: 15.RK3588_SARADC_1.8V Only GPIO (U1000.AE32), 67.Ethernet-GEPHY_RGMII0 (C6724.1 R6741.2)
GMAC0_RXD0: 15.RK3588_SARADC_1.8V Only GPIO (U1000.AD32), 67.Ethernet-GEPHY_RGMII0 (R6737.2)
GMAC0_RXD1: 15.RK3588_SARADC_1.8V Only GPIO (U1000.AD31), 67.Ethernet-GEPHY_RGMII0 (R6738.2)
GMAC0_RXD2: 15.RK3588_SARADC_1.8V Only GPIO (U1000.AC32), 67.Ethernet-GEPHY_RGMII0 (R6739.2)
GMAC0_RXD3: 15.RK3588_SARADC_1.8V Only GPIO (U1000.AC31), 67.Ethernet-GEPHY_RGMII0 (R6740.2)
GMAC0_RXDV_CRS: 15.RK3588_SARADC_1.8V Only GPIO (U1000.AE31), 67.Ethernet-GEPHY_RGMII0 (R6742.2)
GMAC0_TXCLK: 15.RK3588_SARADC_1.8V Only GPIO (R1506.2), 67.Ethernet-GEPHY_RGMII0 (C6726.1 U6701.20)
GMAC0_TXD0: 15.RK3588_SARADC_1.8V Only GPIO (R1507.2), 67.Ethernet-GEPHY_RGMII0 (U6701.18)
GMAC0_TXD1: 15.RK3588_SARADC_1.8V Only GPIO (R1508.2), 67.Ethernet-GEPHY_RGMII0 (U6701.17)
GMAC0_TXD2: 15.RK3588_SARADC_1.8V Only GPIO (R1504.2), 67.Ethernet-GEPHY_RGMII0 (U6701.16)
GMAC0_TXD3: 15.RK3588_SARADC_1.8V Only GPIO (R1505.2), 67.Ethernet-GEPHY_RGMII0 (U6701.15)
GMAC0_TXEN: 15.RK3588_SARADC_1.8V Only GPIO (R1509.2), 67.Ethernet-GEPHY_RGMII0 (U6701.19)
GMAC1_MCLKINOUT: 19.RK3588_1.8V_ 3.3V GPIO (R1910.2), 68.Ethernet-GEPHY_RGMII1 (C6806.1 R6814.1 R6815.1)
GMAC1_MDC: 19.RK3588_1.8V_ 3.3V GPIO (R1911.2), 68.Ethernet-GEPHY_RGMII1 (U6801.13)
GMAC1_MDIO: 19.RK3588_1.8V_ 3.3V GPIO (U1000.Y30), 68.Ethernet-GEPHY_RGMII1 (R6835.2 U6801.14)
GMAC1_RSTn_L_GPIO4_A2: 19.RK3588_1.8V_ 3.3V GPIO (U1000.AM29), 68.Ethernet-GEPHY_RGMII1 (R6836.1)
GMAC1_RXCLK: 19.RK3588_1.8V_ 3.3V GPIO (R1905.2), 68.Ethernet-GEPHY_RGMII1 (C6823.1 R6841.2)
GMAC1_RXD0: 19.RK3588_1.8V_ 3.3V GPIO (U1000.AG29), 68.Ethernet-GEPHY_RGMII1 (R6837.2)
GMAC1_RXD1: 19.RK3588_1.8V_ 3.3V GPIO (U1000.AG28), 68.Ethernet-GEPHY_RGMII1 (R6838.2)
GMAC1_RXD2: 19.RK3588_1.8V_ 3.3V GPIO (R1902.2), 68.Ethernet-GEPHY_RGMII1 (R6839.2)
GMAC1_RXD3: 19.RK3588_1.8V_ 3.3V GPIO (R1903.2), 68.Ethernet-GEPHY_RGMII1 (R6840.2)
GMAC1_RXDV_CRS: 19.RK3588_1.8V_ 3.3V GPIO (U1000.AH29), 68.Ethernet-GEPHY_RGMII1 (R6842.2)
GMAC1_TXCLK: 19.RK3588_1.8V_ 3.3V GPIO (R1904.2), 68.Ethernet-GEPHY_RGMII1 (C6826.1 U6801.20)
GMAC1_TXD0: 19.RK3588_1.8V_ 3.3V GPIO (R1907.2), 68.Ethernet-GEPHY_RGMII1 (U6801.18)
GMAC1_TXD1: 19.RK3588_1.8V_ 3.3V GPIO (R1908.2), 68.Ethernet-GEPHY_RGMII1 (U6801.17)
GMAC1_TXD2: 19.RK3588_1.8V_ 3.3V GPIO (R1900.2), 68.Ethernet-GEPHY_RGMII1 (U6801.16)
GMAC1_TXD3: 19.RK3588_1.8V_ 3.3V GPIO (R1901.2), 68.Ethernet-GEPHY_RGMII1 (U6801.15)
GMAC1_TXEN: 19.RK3588_1.8V_ 3.3V GPIO (R1909.2), 68.Ethernet-GEPHY_RGMII1 (U6801.19)
HDD_LED_EN_H_GPIO3_C1: 19.RK3588_1.8V_ 3.3V GPIO (U1000.Y27), 90.IR Receiver_LED (R9008.1)
HDMI0_TX0N_PORT: 17.RK3588_HDMI_eDP Interface (C1701.2 R1706.1), 50.VO-HDMI2.1 TX (ED5001.2 ED5001.9 J5000.9)
HDMI0_TX0P_PORT: 17.RK3588_HDMI_eDP Interface (C1700.2 R1707.1), 50.VO-HDMI2.1 TX (ED5001.1 ED5001.10 J5000.7)
HDMI0_TX1N_PORT: 17.RK3588_HDMI_eDP Interface (C1703.2 R1704.1), 50.VO-HDMI2.1 TX (ED5000.5 ED5000.6 J5000.6)
HDMI0_TX1P_PORT: 17.RK3588_HDMI_eDP Interface (C1702.2 R1705.1), 50.VO-HDMI2.1 TX (ED5000.4 ED5000.7 J5000.4)
HDMI0_TX2N_PORT: 17.RK3588_HDMI_eDP Interface (C1705.2 R1702.1), 50.VO-HDMI2.1 TX (ED5000.2 ED5000.9 J5000.3)
HDMI0_TX2P_PORT: 17.RK3588_HDMI_eDP Interface (C1704.2 R1703.1), 50.VO-HDMI2.1 TX (ED5000.1 ED5000.10 J5000.1)
HDMI0_TX3N_PORT: 17.RK3588_HDMI_eDP Interface (C1707.2 R1700.1), 50.VO-HDMI2.1 TX (ED5001.5 ED5001.6 J5000.12)
HDMI0_TX3P_PORT: 17.RK3588_HDMI_eDP Interface (C1706.2 R1701.1), 50.VO-HDMI2.1 TX (ED5001.4 ED5001.7 J5000.10)
HDMI0_TX_ON_H: 17.RK3588_HDMI_eDP Interface (Q1700.1 Q1701.1 Q1702.1 Q1703.1), 19.RK3588_1.8V_ 3.3V GPIO (U1000.AL24)
HDMI1_TX0N_PORT: 17.RK3588_HDMI_eDP Interface (C1717.2 R1715.1), 50.VO-HDMI2.1 TX (ED5007.2 ED5007.9 J5001.9)
HDMI1_TX0P_PORT: 17.RK3588_HDMI_eDP Interface (C1716.2 R1716.1), 50.VO-HDMI2.1 TX (ED5007.1 ED5007.10 J5001.7)
HDMI1_TX1N_PORT: 17.RK3588_HDMI_eDP Interface (C1719.2 R1713.1), 50.VO-HDMI2.1 TX (ED5006.5 ED5006.6 J5001.6)
HDMI1_TX1P_PORT: 17.RK3588_HDMI_eDP Interface (C1718.2 R1714.1), 50.VO-HDMI2.1 TX (ED5006.4 ED5006.7 J5001.4)
HDMI1_TX2N_PORT: 17.RK3588_HDMI_eDP Interface (C1721.2 R1711.1), 50.VO-HDMI2.1 TX (ED5006.2 ED5006.9 J5001.3)
HDMI1_TX2P_PORT: 17.RK3588_HDMI_eDP Interface (C1720.2 R1712.1), 50.VO-HDMI2.1 TX (ED5006.1 ED5006.10 J5001.1)
HDMI1_TX3N_PORT: 17.RK3588_HDMI_eDP Interface (C1723.2 R1709.1), 50.VO-HDMI2.1 TX (ED5007.5 ED5007.6 J5001.12)
HDMI1_TX3P_PORT: 17.RK3588_HDMI_eDP Interface (C1722.2 R1710.1), 50.VO-HDMI2.1 TX (ED5007.4 ED5007.7 J5001.10)
HDMI1_TX_ON_H: 17.RK3588_HDMI_eDP Interface (Q1704.1 Q1705.1 Q1706.1 Q1707.1), 19.RK3588_1.8V_ 3.3V GPIO (U1000.AK25)
HDMITX0_CEC_M0: 19.RK3588_1.8V_ 3.3V GPIO (U1000.AK24), 50.VO-HDMI2.1 TX (R5011.1)
HDMITX0_HPDIN_M0: 19.RK3588_1.8V_ 3.3V GPIO (U1000.B26), 50.VO-HDMI2.1 TX (Q5006.3 R5000.2)
HDMITX0_SCL_M0: 19.RK3588_1.8V_ 3.3V GPIO (U1000.AJ28), 50.VO-HDMI2.1 TX (R5003.1)
HDMITX0_SDA_M0: 19.RK3588_1.8V_ 3.3V GPIO (U1000.AJ25), 50.VO-HDMI2.1 TX (R5008.1)
HDMITX1_CEC_M2: 19.RK3588_1.8V_ 3.3V GPIO (R1912.2), 50.VO-HDMI2.1 TX (R5023.1)
HDMITX1_HPDIN_M0: 19.RK3588_1.8V_ 3.3V GPIO (U1000.C24), 50.VO-HDMI2.1 TX (Q5008.3 R5014.2)
HDMITX1_SCL_M1: 19.RK3588_1.8V_ 3.3V GPIO (U1000.AG26), 50.VO-HDMI2.1 TX (R5015.1)
HDMITX1_SDA_M1: 19.RK3588_1.8V_ 3.3V GPIO (U1000.AH25), 50.VO-HDMI2.1 TX (R5020.1)
I2C0_SCL_M2: 11.RK3588_OSC_PLL_PMUIO (R1118.2 U1000.W30), 22.Power_Ext Discrete_RTC IC (U2200.A3 U2201.A3)
I2C0_SDA_M2: 11.RK3588_OSC_PLL_PMUIO (R1117.2 U1000.W29), 22.Power_Ext Discrete_RTC IC (U2200.B1 U2201.B1)
I2C2_SCL_M0: 11.RK3588_OSC_PLL_PMUIO (R1112.2 U1000.T28), 22.Power_Ext Discrete_RTC IC (U2202.A3)
I2C2_SDA_M0: 11.RK3588_OSC_PLL_PMUIO (R1111.2 U1000.T31), 22.Power_Ext Discrete_RTC IC (U2202.B1)
I2C3_SCL_M0: 15.RK3588_SARADC_1.8V Only GPIO (R1500.2 U1000.G27), 70.Audio Port (U7000.1)
I2C3_SDA_M0: 15.RK3588_SARADC_1.8V Only GPIO (R1501.2 U1000.G29), 70.Audio Port (U7000.19)
I2C4_SCL_M3_MIPI: 19.RK3588_1.8V_ 3.3V GPIO (R1913.2 U1000.A27), 47.VI-Camera_MIPI-CSI (U4700.48)
I2C4_SDA_M3_MIPI: 19.RK3588_1.8V_ 3.3V GPIO (R1914.2 U1000.A26), 47.VI-Camera_MIPI-CSI (U4700.46)
I2C5_SCL_M3_MIPI: 19.RK3588_1.8V_ 3.3V GPIO (R1916.2 U1000.E26), 47.VI-Camera_MIPI-CSI (U4700.47)
I2C5_SDA_M3_MIPI: 19.RK3588_1.8V_ 3.3V GPIO (R1915.2 U1000.E27), 47.VI-Camera_MIPI-CSI (U4700.45)
I2C6_SCL_M0: 11.RK3588_OSC_PLL_PMUIO (R1115.2 U1000.W31), 22.Power_Ext Discrete_RTC IC (R2209.2), 25.USB2_USB3_TypeC Port (U2503.6), 55.VO-HDMI1.4 TX(MIPI to HDMI) (R5502.2)
I2C6_SDA_M0: 11.RK3588_OSC_PLL_PMUIO (R1116.2 U1000.V31), 22.Power_Ext Discrete_RTC IC (R2210.2), 25.USB2_USB3_TypeC Port (U2503.7), 55.VO-HDMI1.4 TX(MIPI to HDMI) (R5501.2)
I2S0_LRCK_RX/PWM15_M2: 15.RK3588_SARADC_1.8V Only GPIO (U1000.D29), 47.VI-Camera_MIPI-CSI (R4735.2)
I2S0_LRCK_TX: 15.RK3588_SARADC_1.8V Only GPIO (U1000.D30), 70.Audio Port (U7000.8)
I2S0_MCLK: 15.RK3588_SARADC_1.8V Only GPIO (U1000.F30), 70.Audio Port (U7000.2)
I2S0_SCLK_RX/PWM11_M2: 15.RK3588_SARADC_1.8V Only GPIO (U1000.E30), 47.VI-Camera_MIPI-CSI (R4734.1)
I2S0_SCLK_TX: 15.RK3588_SARADC_1.8V Only GPIO (U1000.E31), 70.Audio Port (U7000.6)
I2S0_SDI0: 15.RK3588_SARADC_1.8V Only GPIO (U1000.D28), 70.Audio Port (U7000.7)
I2S0_SDI1/PWM1_M1: 15.RK3588_SARADC_1.8V Only GPIO (U1000.E28), 47.VI-Camera_MIPI-CSI (R4736.1)
I2S0_SDO0: 15.RK3588_SARADC_1.8V Only GPIO (U1000.E29), 70.Audio Port (U7000.9)
IT6161_INT_GPIO0_C4: 11.RK3588_OSC_PLL_PMUIO (U1000.R30), 55.VO-HDMI1.4 TX(MIPI to HDMI) (R5500.2)
IT6161_SYSRSTN_GPIO0_C5: 11.RK3588_OSC_PLL_PMUIO (U1000.P30), 55.VO-HDMI1.4 TX(MIPI to HDMI) (R5503.2)
JTAG_TCK_M0: 13.RK3588_Flash_SD Controller (U1000.AF2), 91.Debug UART_JTAG (R9107.1)
JTAG_TMS_M0: 13.RK3588_Flash_SD Controller (U1000.AF1), 91.Debug UART_JTAG (R9106.1)
LAN1_A+: 67.Ethernet-GEPHY_RGMII0 (J6700.B1), 68.Ethernet-GEPHY_RGMII1 (U6800.13)
LAN1_A-: 67.Ethernet-GEPHY_RGMII0 (J6700.B2), 68.Ethernet-GEPHY_RGMII1 (U6800.14)
LAN1_B+: 67.Ethernet-GEPHY_RGMII0 (J6700.B3), 68.Ethernet-GEPHY_RGMII1 (U6800.16)
LAN1_B-: 67.Ethernet-GEPHY_RGMII0 (J6700.B6), 68.Ethernet-GEPHY_RGMII1 (U6800.17)
LAN1_C+: 67.Ethernet-GEPHY_RGMII0 (J6700.B4), 68.Ethernet-GEPHY_RGMII1 (U6800.19)
LAN1_C-: 67.Ethernet-GEPHY_RGMII0 (J6700.B5), 68.Ethernet-GEPHY_RGMII1 (U6800.20)
LAN1_D+: 67.Ethernet-GEPHY_RGMII0 (J6700.B7), 68.Ethernet-GEPHY_RGMII1 (U6800.22)
LAN1_D-: 67.Ethernet-GEPHY_RGMII0 (J6700.B8), 68.Ethernet-GEPHY_RGMII1 (U6800.23)
MCU_JTAG_TCK_M0/UART5_RX_M0: 13.RK3588_Flash_SD Controller (U1000.AE2), 91.Debug UART_JTAG (R9109.1)
MCU_JTAG_TMS_M0/UART5_TX_M0: 13.RK3588_Flash_SD Controller (U1000.AE1), 91.Debug UART_JTAG (R9108.1)
MIPI_CAM3_CLKOUT: 19.RK3588_1.8V_ 3.3V GPIO (R1917.2), 47.VI-Camera_MIPI-CSI (U4700.39)
MIPI_CAM4_CLKOUT: 19.RK3588_1.8V_ 3.3V GPIO (R1918.2), 47.VI-Camera_MIPI-CSI (U4700.40)
MIPI_CSI0_PDN0_H_GPIO1_B3: 19.RK3588_1.8V_ 3.3V GPIO (U1000.D27), 47.VI-Camera_MIPI-CSI (U4700.51)
MIPI_CSI0_PDN1_H_GPIO1_A7: 19.RK3588_1.8V_ 3.3V GPIO (U1000.C25), 47.VI-Camera_MIPI-CSI (U4700.55)
MIPI_CSI0_RST_GPIO1_A4: 19.RK3588_1.8V_ 3.3V GPIO (U1000.B25), 47.VI-Camera_MIPI-CSI (U4700.49)
MIPI_CSI0_RX_CLK0N: 16.RK3588_MIPI  Interface (U1000.AJ34), 47.VI-Camera_MIPI-CSI (U4700.15)
MIPI_CSI0_RX_CLK0P: 16.RK3588_MIPI  Interface (U1000.AJ33), 47.VI-Camera_MIPI-CSI (U4700.17)
MIPI_CSI0_RX_CLK1N: 16.RK3588_MIPI  Interface (U1000.AM34), 47.VI-Camera_MIPI-CSI (U4700.33)
MIPI_CSI0_RX_CLK1P: 16.RK3588_MIPI  Interface (U1000.AM33), 47.VI-Camera_MIPI-CSI (U4700.35)
MIPI_CSI0_RX_D0N: 16.RK3588_MIPI  Interface (U1000.AG34), 47.VI-Camera_MIPI-CSI (U4700.3)
MIPI_CSI0_RX_D0P: 16.RK3588_MIPI  Interface (U1000.AG33), 47.VI-Camera_MIPI-CSI (U4700.5)
MIPI_CSI0_RX_D1N: 16.RK3588_MIPI  Interface (U1000.AH34), 47.VI-Camera_MIPI-CSI (U4700.9)
MIPI_CSI0_RX_D1P: 16.RK3588_MIPI  Interface (U1000.AH33), 47.VI-Camera_MIPI-CSI (U4700.11)
MIPI_CSI0_RX_D2N: 16.RK3588_MIPI  Interface (U1000.AK34), 47.VI-Camera_MIPI-CSI (U4700.21)
MIPI_CSI0_RX_D2P: 16.RK3588_MIPI  Interface (U1000.AK33), 47.VI-Camera_MIPI-CSI (U4700.23)
MIPI_CSI0_RX_D3N: 16.RK3588_MIPI  Interface (U1000.AL34), 47.VI-Camera_MIPI-CSI (U4700.27)
MIPI_CSI0_RX_D3P: 16.RK3588_MIPI  Interface (U1000.AL33), 47.VI-Camera_MIPI-CSI (U4700.29)
MIPI_CSI1_PDN0_H_GPIO1_B4: 19.RK3588_1.8V_ 3.3V GPIO (U1000.E24), 47.VI-Camera_MIPI-CSI (U4700.52)
MIPI_CSI1_PDN1_H_GPIO1_B0: 19.RK3588_1.8V_ 3.3V GPIO (U1000.C27), 47.VI-Camera_MIPI-CSI (U4700.56)
MIPI_CSI1_RST_GPIO1_B5: 19.RK3588_1.8V_ 3.3V GPIO (U1000.E25), 47.VI-Camera_MIPI-CSI (U4700.50)
MIPI_CSI1_RX_CLK0N: 16.RK3588_MIPI  Interface (U1000.AJ32), 47.VI-Camera_MIPI-CSI (U4700.16)
MIPI_CSI1_RX_CLK0P: 16.RK3588_MIPI  Interface (U1000.AJ31), 47.VI-Camera_MIPI-CSI (U4700.18)
MIPI_CSI1_RX_CLK1N: 16.RK3588_MIPI  Interface (U1000.AM32), 47.VI-Camera_MIPI-CSI (U4700.34)
MIPI_CSI1_RX_CLK1P: 16.RK3588_MIPI  Interface (U1000.AM31), 47.VI-Camera_MIPI-CSI (U4700.36)
MIPI_CSI1_RX_D0N: 16.RK3588_MIPI  Interface (U1000.AG32), 47.VI-Camera_MIPI-CSI (U4700.4)
MIPI_CSI1_RX_D0P: 16.RK3588_MIPI  Interface (U1000.AG31), 47.VI-Camera_MIPI-CSI (U4700.6)
MIPI_CSI1_RX_D1N: 16.RK3588_MIPI  Interface (U1000.AH32), 47.VI-Camera_MIPI-CSI (U4700.10)
MIPI_CSI1_RX_D1P: 16.RK3588_MIPI  Interface (U1000.AH31), 47.VI-Camera_MIPI-CSI (U4700.12)
MIPI_CSI1_RX_D2N: 16.RK3588_MIPI  Interface (U1000.AK32), 47.VI-Camera_MIPI-CSI (U4700.22)
MIPI_CSI1_RX_D2P: 16.RK3588_MIPI  Interface (U1000.AK31), 47.VI-Camera_MIPI-CSI (U4700.24)
MIPI_CSI1_RX_D3N: 16.RK3588_MIPI  Interface (U1000.AL32), 47.VI-Camera_MIPI-CSI (U4700.28)
MIPI_CSI1_RX_D3P: 16.RK3588_MIPI  Interface (U1000.AL31), 47.VI-Camera_MIPI-CSI (U4700.30)
MIPI_DPHY1_TX_CLKN: 16.RK3588_MIPI  Interface (U1000.AP20), 55.VO-HDMI1.4 TX(MIPI to HDMI) (R5525.1)
MIPI_DPHY1_TX_CLKP: 16.RK3588_MIPI  Interface (U1000.AN20), 55.VO-HDMI1.4 TX(MIPI to HDMI) (R5526.1)
MIPI_DPHY1_TX_D0N: 16.RK3588_MIPI  Interface (U1000.AP18), 55.VO-HDMI1.4 TX(MIPI to HDMI) (R5530.1)
MIPI_DPHY1_TX_D0P: 16.RK3588_MIPI  Interface (U1000.AN18), 55.VO-HDMI1.4 TX(MIPI to HDMI) (R5532.1)
MIPI_DPHY1_TX_D1N: 16.RK3588_MIPI  Interface (U1000.AP19), 55.VO-HDMI1.4 TX(MIPI to HDMI) (R5527.1)
MIPI_DPHY1_TX_D1P: 16.RK3588_MIPI  Interface (U1000.AN19), 55.VO-HDMI1.4 TX(MIPI to HDMI) (R5529.1)
MIPI_DPHY1_TX_D2N: 16.RK3588_MIPI  Interface (U1000.AP21), 55.VO-HDMI1.4 TX(MIPI to HDMI) (R5523.1)
MIPI_DPHY1_TX_D2P: 16.RK3588_MIPI  Interface (U1000.AN21), 55.VO-HDMI1.4 TX(MIPI to HDMI) (R5524.1)
MIPI_DPHY1_TX_D3N: 16.RK3588_MIPI  Interface (U1000.AP22), 55.VO-HDMI1.4 TX(MIPI to HDMI) (R5520.1)
MIPI_DPHY1_TX_D3P: 16.RK3588_MIPI  Interface (U1000.AN22), 55.VO-HDMI1.4 TX(MIPI to HDMI) (R5521.1)
MIPICSI0_PWREN_H_GPIO1_B1: 19.RK3588_1.8V_ 3.3V GPIO (U1000.D25), 47.VI-Camera_MIPI-CSI (U4700.65)
MIPICSI1_PWREN_H_GPIO1_B2: 19.RK3588_1.8V_ 3.3V GPIO (U1000.D26), 47.VI-Camera_MIPI-CSI (U4700.66)
PCIE30_PORT0_REFCLKN_IN: 18.RK3588_PCIE30_PCIE20_SATA30 (U1000.E34), 84.PCIE-PCIE3.0_1x4Lanes_RC_64P (R8416.2 R8418.1)
PCIE30_PORT0_REFCLKP_IN: 18.RK3588_PCIE30_PCIE20_SATA30 (U1000.E33), 84.PCIE-PCIE3.0_1x4Lanes_RC_64P (R8415.2 R8419.1)
PCIE30_PORT0_RX0N: 18.RK3588_PCIE30_PCIE20_SATA30 (U1000.G34), 84.PCIE-PCIE3.0_1x4Lanes_RC_64P (J8400.A17)
PCIE30_PORT0_RX0P: 18.RK3588_PCIE30_PCIE20_SATA30 (U1000.G33), 84.PCIE-PCIE3.0_1x4Lanes_RC_64P (J8400.A16)
PCIE30_PORT0_RX1N: 18.RK3588_PCIE30_PCIE20_SATA30 (U1000.F33), 84.PCIE-PCIE3.0_1x4Lanes_RC_64P (J8400.A22)
PCIE30_PORT0_RX1P: 18.RK3588_PCIE30_PCIE20_SATA30 (U1000.F32), 84.PCIE-PCIE3.0_1x4Lanes_RC_64P (J8400.A21)
PCIE30_PORT0_TX0N: 18.RK3588_PCIE30_PCIE20_SATA30 (U1000.D33), 84.PCIE-PCIE3.0_1x4Lanes_RC_64P (C8402.1)
PCIE30_PORT0_TX0P: 18.RK3588_PCIE30_PCIE20_SATA30 (U1000.D32), 84.PCIE-PCIE3.0_1x4Lanes_RC_64P (C8401.1)
PCIE30_PORT0_TX1N: 18.RK3588_PCIE30_PCIE20_SATA30 (U1000.C34), 84.PCIE-PCIE3.0_1x4Lanes_RC_64P (C8404.1)
PCIE30_PORT0_TX1P: 18.RK3588_PCIE30_PCIE20_SATA30 (U1000.C33), 84.PCIE-PCIE3.0_1x4Lanes_RC_64P (C8403.1)
PCIE30_PORT1_REFCLKN_IN: 18.RK3588_PCIE30_PCIE20_SATA30 (U1000.B28), 84.PCIE-PCIE3.0_1x4Lanes_RC_64P (R8424.2 R8425.1)
PCIE30_PORT1_REFCLKP_IN: 18.RK3588_PCIE30_PCIE20_SATA30 (U1000.A28), 84.PCIE-PCIE3.0_1x4Lanes_RC_64P (R8423.2 R8426.1)
PCIE30_PORT1_RX2N: 18.RK3588_PCIE30_PCIE20_SATA30 (U1000.A32), 84.PCIE-PCIE3.0_1x4Lanes_RC_64P (J8400.A26)
PCIE30_PORT1_RX2P: 18.RK3588_PCIE30_PCIE20_SATA30 (U1000.B32), 84.PCIE-PCIE3.0_1x4Lanes_RC_64P (J8400.A25)
PCIE30_PORT1_RX3N: 18.RK3588_PCIE30_PCIE20_SATA30 (U1000.B31), 84.PCIE-PCIE3.0_1x4Lanes_RC_64P (J8400.A30)
PCIE30_PORT1_RX3P: 18.RK3588_PCIE30_PCIE20_SATA30 (U1000.C31), 84.PCIE-PCIE3.0_1x4Lanes_RC_64P (J8400.A29)
PCIE30_PORT1_TX2N: 18.RK3588_PCIE30_PCIE20_SATA30 (U1000.A30), 84.PCIE-PCIE3.0_1x4Lanes_RC_64P (C8406.1)
PCIE30_PORT1_TX2P: 18.RK3588_PCIE30_PCIE20_SATA30 (U1000.B30), 84.PCIE-PCIE3.0_1x4Lanes_RC_64P (C8405.1)
PCIE30_PORT1_TX3N: 18.RK3588_PCIE30_PCIE20_SATA30 (U1000.B29), 84.PCIE-PCIE3.0_1x4Lanes_RC_64P (C8408.1)
PCIE30_PORT1_TX3P: 18.RK3588_PCIE30_PCIE20_SATA30 (U1000.C29), 84.PCIE-PCIE3.0_1x4Lanes_RC_64P (C8407.1)
PCIE30X4_CLKREQn_M1_L: 19.RK3588_1.8V_ 3.3V GPIO (R1922.1 U1000.AL26), 84.PCIE-PCIE3.0_1x4Lanes_RC_64P (R8400.1)
PCIE30X4_PERSTn_M1_L: 19.RK3588_1.8V_ 3.3V GPIO (U1000.AJ27), 84.PCIE-PCIE3.0_1x4Lanes_RC_64P (R8402.1)
PCIE30X4_PRSNT_L_GPIO3_C7: 19.RK3588_1.8V_ 3.3V GPIO (U1000.AJ24), 84.PCIE-PCIE3.0_1x4Lanes_RC_64P (R8403.1)
PCIE30x4_PWREN_H_GPIO3_D5: 19.RK3588_1.8V_ 3.3V GPIO (U1000.AB28), 84.PCIE-PCIE3.0_1x4Lanes_RC_64P (R8427.1 R8429.1 R8434.1)
PCIE30X4_WAKEn_M1_L: 19.RK3588_1.8V_ 3.3V GPIO (U1000.AJ26), 84.PCIE-PCIE3.0_1x4Lanes_RC_64P (R8401.1)
PMIC_EXT_EN_OUT: 20.Power_DC IN (R2011.1 R2021.1), 21.Power-PMIC_RK806-1 (U2100.39)
PMIC_INT_L: 11.RK3588_OSC_PLL_PMUIO (U1000.M30), 21.Power-PMIC_RK806-1 (R2137.2 U2100.19)
PMIC_PWR_CTRL1: 11.RK3588_OSC_PLL_PMUIO (R1103.2), 21.Power-PMIC_RK806-1 (U2100.62)
PMIC_PWR_CTRL2: 11.RK3588_OSC_PLL_PMUIO (R1113.2 R1114.1), 21.Power-PMIC_RK806-1 (U2100.61)
PMIC_PWR_CTRL3: 11.RK3588_OSC_PLL_PMUIO (R1108.2 R1109.2 R1110.1), 21.Power-PMIC_RK806-1 (U2100.16)
PMIC_SPI_CLK: 11.RK3588_OSC_PLL_PMUIO (R1104.2), 21.Power-PMIC_RK806-1 (U2100.17)
PMIC_SPI_CS: 11.RK3588_OSC_PLL_PMUIO (R1106.2), 21.Power-PMIC_RK806-1 (R2134.1 U2100.18)
PMIC_SPI_MOSI: 11.RK3588_OSC_PLL_PMUIO (R1105.2 R1107.2), 21.Power-PMIC_RK806-1 (R2150.1 U2100.15)
Power_LED_EN_H_GPIO3_B7: 19.RK3588_1.8V_ 3.3V GPIO (U1000.AA28), 90.IR Receiver_LED (R9006.1)
PWM3_IR_M0: 11.RK3588_OSC_PLL_PMUIO (U1000.V29), 90.IR Receiver_LED (C9000.1 R9001.1)
PWM8_M1_BEEP: 13.RK3588_Flash_SD Controller (U1000.AD2), 70.Audio Port (R7005.1)
PWM9_M1_FAN: 13.RK3588_Flash_SD Controller (U1000.AD1), 99.Mark_Hole_Heatsink (Q9501.2 R9902.1 R9904.2)
RECOVERY_KEY: 15.RK3588_SARADC_1.8V Only GPIO (C1501.1 R1502.2 TP1500.1 U1000.AL16), 92.KEY (R9200.1)
RESET_L: 11.RK3588_OSC_PLL_PMUIO (C1100.1 R1102.1 U1000.M31), 21.Power-PMIC_RK806-1 (C2166.1 R2138.2 U2100.40), 92.KEY (R9201.1)
RTCIC_INT_L_GPIO0_B2: 11.RK3588_OSC_PLL_PMUIO (U1000.K29), 22.Power_Ext Discrete_RTC IC (U2203.3)
SARADC_VIN5_HW_ID: 15.RK3588_SARADC_1.8V Only GPIO (C1502.1 U1000.AK15), 93.HW_ID (R9300.2 R9301.1)
SATA30_0_RXN: 18.RK3588_PCIE30_PCIE20_SATA30 (U1000.N34), 82.SATA-SATA PM0 (C8216.1)
SATA30_0_RXP: 18.RK3588_PCIE30_PCIE20_SATA30 (U1000.N33), 82.SATA-SATA PM0 (C8218.1)
SATA30_0_TXN: 18.RK3588_PCIE30_PCIE20_SATA30 (U1000.M33), 82.SATA-SATA PM0 (C8210.1)
SATA30_0_TXP: 18.RK3588_PCIE30_PCIE20_SATA30 (U1000.M34), 82.SATA-SATA PM0 (C8212.1)
SATA30_1_RXN: 18.RK3588_PCIE30_PCIE20_SATA30 (U1000.J34), 83.SATA-SATA PM1 (C8316.1)
SATA30_1_RXP: 18.RK3588_PCIE30_PCIE20_SATA30 (U1000.J33), 83.SATA-SATA PM1 (C8318.1)
SATA30_1_TXN: 18.RK3588_PCIE30_PCIE20_SATA30 (U1000.K34), 83.SATA-SATA PM1 (C8312.1)
SATA30_1_TXP: 18.RK3588_PCIE30_PCIE20_SATA30 (U1000.K33), 83.SATA-SATA PM1 (C8310.1)
SATAPM0_RSTn_L_GPIO4_A0: 19.RK3588_1.8V_ 3.3V GPIO (U1000.AK30), 82.SATA-SATA PM0 (R8201.1)
SATAPM1_RSTn_L_GPIO4_A1: 19.RK3588_1.8V_ 3.3V GPIO (U1000.AL30), 83.SATA-SATA PM1 (R8301.1)
SPDIF0_TX_M1: 19.RK3588_1.8V_ 3.3V GPIO (R1922.2), 55.VO-HDMI1.4 TX(MIPI to HDMI) (R5506.1 U5500.53)
TYPEC0_SBU1/DP0_AUXP: 14.RK3588_USB30_USB20_Ctrl (U1000.AL15), 25.USB2_USB3_TypeC Port (C2522.1)
TYPEC0_SBU1_DC: 11.RK3588_OSC_PLL_PMUIO (U1000.T29), 25.USB2_USB3_TypeC Port (R2533.1)
TYPEC0_SBU2/DP0_AUXN: 14.RK3588_USB30_USB20_Ctrl (U1000.AM15), 25.USB2_USB3_TypeC Port (C2523.1)
TYPEC0_SBU2_DC: 11.RK3588_OSC_PLL_PMUIO (U1000.U33), 25.USB2_USB3_TypeC Port (R2534.1)
TYPEC0_SSRX1N: 14.RK3588_USB30_USB20_Ctrl (U1000.AP13), 25.USB2_USB3_TypeC Port (R2502.1)
TYPEC0_SSRX1P: 14.RK3588_USB30_USB20_Ctrl (U1000.AN13), 25.USB2_USB3_TypeC Port (R2503.1)
TYPEC0_SSRX2N: 14.RK3588_USB30_USB20_Ctrl (U1000.AP15), 25.USB2_USB3_TypeC Port (R2537.1)
TYPEC0_SSRX2P: 14.RK3588_USB30_USB20_Ctrl (U1000.AN15), 25.USB2_USB3_TypeC Port (R2538.1)
TYPEC0_SSTX1N: 14.RK3588_USB30_USB20_Ctrl (U1000.AN14), 25.USB2_USB3_TypeC Port (C2501.1)
TYPEC0_SSTX1P: 14.RK3588_USB30_USB20_Ctrl (U1000.AP14), 25.USB2_USB3_TypeC Port (C2502.1)
TYPEC0_SSTX2N: 14.RK3588_USB30_USB20_Ctrl (U1000.AN16), 25.USB2_USB3_TypeC Port (C2524.1)
TYPEC0_SSTX2P: 14.RK3588_USB30_USB20_Ctrl (U1000.AP16), 25.USB2_USB3_TypeC Port (C2525.1)
TYPEC0_USB20_OTG_DM: 14.RK3588_USB30_USB20_Ctrl (U1000.AM12), 25.USB2_USB3_TypeC Port (R2508.1)
TYPEC0_USB20_OTG_DP: 14.RK3588_USB30_USB20_Ctrl (U1000.AL12), 25.USB2_USB3_TypeC Port (R2507.1)
TYPEC0_USB20_VBUSDET: 14.RK3588_USB30_USB20_Ctrl (U1000.AM14), 25.USB2_USB3_TypeC Port (R2500.1 R2501.1)
TYPEC1_USB20_OTG_DM: 14.RK3588_USB30_USB20_Ctrl (U1000.AL9), 25.USB2_USB3_TypeC Port (R2524.1)
TYPEC1_USB20_OTG_DP: 14.RK3588_USB30_USB20_Ctrl (U1000.AK9), 25.USB2_USB3_TypeC Port (R2523.1)
UART0_RX_M2: 19.RK3588_1.8V_ 3.3V GPIO (U1000.AL28), 95.RS485_RS232 (R9502.1)
UART0_TX_M2: 19.RK3588_1.8V_ 3.3V GPIO (U1000.AL29), 95.RS485_RS232 (R9507.1 R9509.1)
UART2_RX_M0_DEBUG: 11.RK3588_OSC_PLL_PMUIO (U1000.R29), 91.Debug UART_JTAG (R9100.1)
UART2_TX_M0_DEBUG: 11.RK3588_OSC_PLL_PMUIO (U1000.P29), 91.Debug UART_JTAG (R9101.1)
UART3_RX_M2: 19.RK3588_1.8V_ 3.3V GPIO (U1000.AL27), 95.RS485_RS232 (R9513.2)
UART3_TX_M2: 19.RK3588_1.8V_ 3.3V GPIO (U1000.AK27), 95.RS485_RS232 (R9514.2)
USB20_HOST0_DM: 14.RK3588_USB30_USB20_Ctrl (U1000.AL6), 25.USB2_USB3_TypeC Port (R2520.1)
USB20_HOST0_DP: 14.RK3588_USB30_USB20_Ctrl (U1000.AK6), 25.USB2_USB3_TypeC Port (R2519.1)
USB20_HOST1_DM: 14.RK3588_USB30_USB20_Ctrl (U1000.AM7), 25.USB2_USB3_TypeC Port (R2530.1)
USB20_HOST1_DP: 14.RK3588_USB30_USB20_Ctrl (U1000.AL7), 25.USB2_USB3_TypeC Port (R2528.1)
USB30_2_SSRXN: 18.RK3588_PCIE30_PCIE20_SATA30 (U1000.J30), 25.USB2_USB3_TypeC Port (R2512.1)
USB30_2_SSRXP: 18.RK3588_PCIE30_PCIE20_SATA30 (U1000.J31), 25.USB2_USB3_TypeC Port (R2514.1)
USB30_2_SSTXN: 18.RK3588_PCIE30_PCIE20_SATA30 (U1000.H29), 25.USB2_USB3_TypeC Port (C2509.1)
USB30_2_SSTXP: 18.RK3588_PCIE30_PCIE20_SATA30 (U1000.H30), 25.USB2_USB3_TypeC Port (C2510.1)
USB_HOST_PWREN_H_GPIO4_B0: 19.RK3588_1.8V_ 3.3V GPIO (U1000.AK26), 25.USB2_USB3_TypeC Port (R2516.1 U2501.4 U2502.4)
USB_OTG_PWREN_H_GPIO4_A7: 19.RK3588_1.8V_ 3.3V GPIO (U1000.AM27), 25.USB2_USB3_TypeC Port (R2510.1 U2500.4)
USBCC_INT_L_GPIO1_A0: 19.RK3588_1.8V_ 3.3V GPIO (U1000.A24), 25.USB2_USB3_TypeC Port (U2503.5)
VSEL2: 11.RK3588_OSC_PLL_PMUIO (U1000.R31), 22.Power_Ext Discrete_RTC IC (U2200.A1)
VSEL3: 11.RK3588_OSC_PLL_PMUIO (U1000.U32), 22.Power_Ext Discrete_RTC IC (U2202.A1)
VSEL6: 11.RK3588_OSC_PLL_PMUIO (U1000.W28), 22.Power_Ext Discrete_RTC IC (U2201.A1)